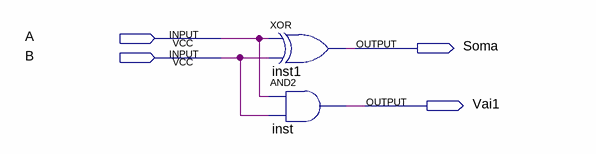
[diagram p0: schematic sheet]
// Quartus schematic MeioSomador.bdf as structural Verilog: 2 symbols, 4 pins
module MeioSomador (
  input  A,
  input  B,
  output Soma,
  output Vai1
);

  xor inst1 (Soma, A, B);
  and inst (Vai1, A, B);
endmodule
